# EAGLE design ArmShield (EAGLE 9.5.2)
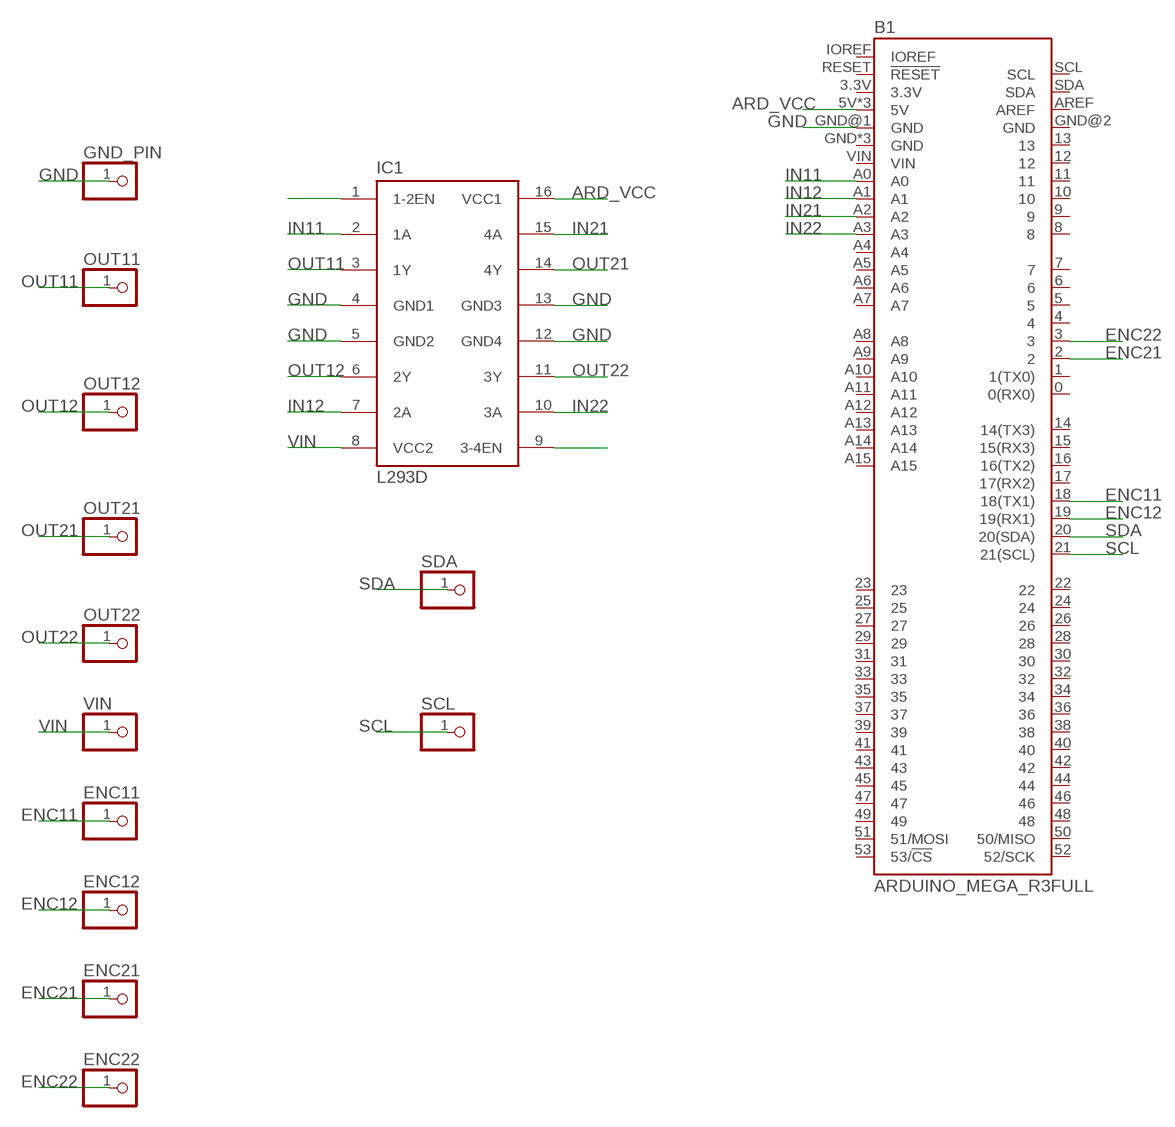
[diagram p0: schematic, sheet 1]

## Parts
B1  ARDUINO_MEGA_R3FULL  [ARDUINO_MEGA_NO_SILK]
ENC11  PINHD-1X1  [1X01]
ENC12  PINHD-1X1  [1X01]
ENC21  PINHD-1X1  [1X01]
ENC22  PINHD-1X1  [1X01]
GND_PIN  PINHD-1X1  [1X01]
IC1  L293D  [DIL16]
OUT11  PINHD-1X1  [1X01]
OUT12  PINHD-1X1  [1X01]
OUT21  PINHD-1X1  [1X01]
OUT22  PINHD-1X1  [1X01]
SCL  PINHD-1X1  [1X01]
SDA  PINHD-1X1  [1X01]
VIN  PINHD-1X1  [1X01]

## Nets
ARD_VCC: B1.5V B1.5V@1(5V) B1.5V@2(5V) IC1.16(VCC1)
ENC11: B1.18(18(TX1)) ENC11.1
ENC12: B1.19(19(RX1)) ENC12.1
ENC21: B1.2 ENC21.1
ENC22: B1.3 ENC22.1
GND: B1.GND@1(GND) GND_PIN.1 IC1.4(GND1) IC1.5(GND2) IC1.12(GND4) IC1.13(GND3)
IN11: B1.A0 IC1.2(1A)
IN12: B1.A1 IC1.7(2A)
IN21: B1.A2 IC1.15(4A)
IN22: B1.A3 IC1.10(3A)
N$2: IC1.1(1-2EN)
N$14: IC1.9(3-4EN)
OUT11: IC1.3(1Y) OUT11.1
OUT12: IC1.6(2Y) OUT12.1
OUT21: IC1.14(4Y) OUT21.1
OUT22: IC1.11(3Y) OUT22.1
SCL: B1.21(21(SCL)) SCL.1
SDA: B1.20(20(SDA)) SDA.1
VIN: IC1.8(VCC2) VIN.1
Unconnected: B1.0(0(RX0)) B1.1(1(TX0)) B1.3.3V B1.4 B1.5 B1.6 B1.7 B1.8 B1.9 B1.10 B1.11 B1.12 B1.13 B1.14(14(TX3)) B1.15(15(RX3)) B1.16(16(TX2)) B1.17(17(RX2)) B1.22 B1.23 B1.24 B1.25 B1.26 B1.27 B1.28 B1.29 B1.30 B1.31 B1.32 B1.33 B1.34 B1.35 B1.36 B1.37 B1.38 B1.39 B1.40 B1.41 B1.42 B1.43 B1.44 B1.45 B1.46 B1.47 B1.48 B1.49 B1.50(50/MISO) B1.51(51/MOSI) B1.52(52/SCK) B1.53(53/!CS) B1.A4 B1.A5 B1.A6 B1.A7 B1.A8 B1.A9 B1.A10 B1.A11 B1.A12 B1.A13 B1.A14 B1.A15 B1.AREF B1.GND B1.GND@2(GND) B1.GND@3(GND) B1.GND@4(GND) B1.IOREF B1.RESET(!RESET) B1.SCL B1.SDA B1.VIN

## Library data of the parts
B1 = SparkFun-Boards:ARDUINO_MEGA_R3: Arduino Mega R3 ATmega2560 R3 compatible footprint. SparkFun Products: Arduino Mega 2560 R3 <https://www.sparkfun.com/products/11061>
ENC11 ENC12 ENC21 ENC22 GND_PIN OUT11 OUT12 OUT21 OUT22 SCL SDA VIN = pinhead:PINHD-1X1: PIN HEADER
IC1 = st-microelectronics:L293D: PUSH-PULL 4 CHANNEL DRIVER; MPN: L293D; OC_FARNELL: 9589619; OC_NEWARK: 56P8249

## Board
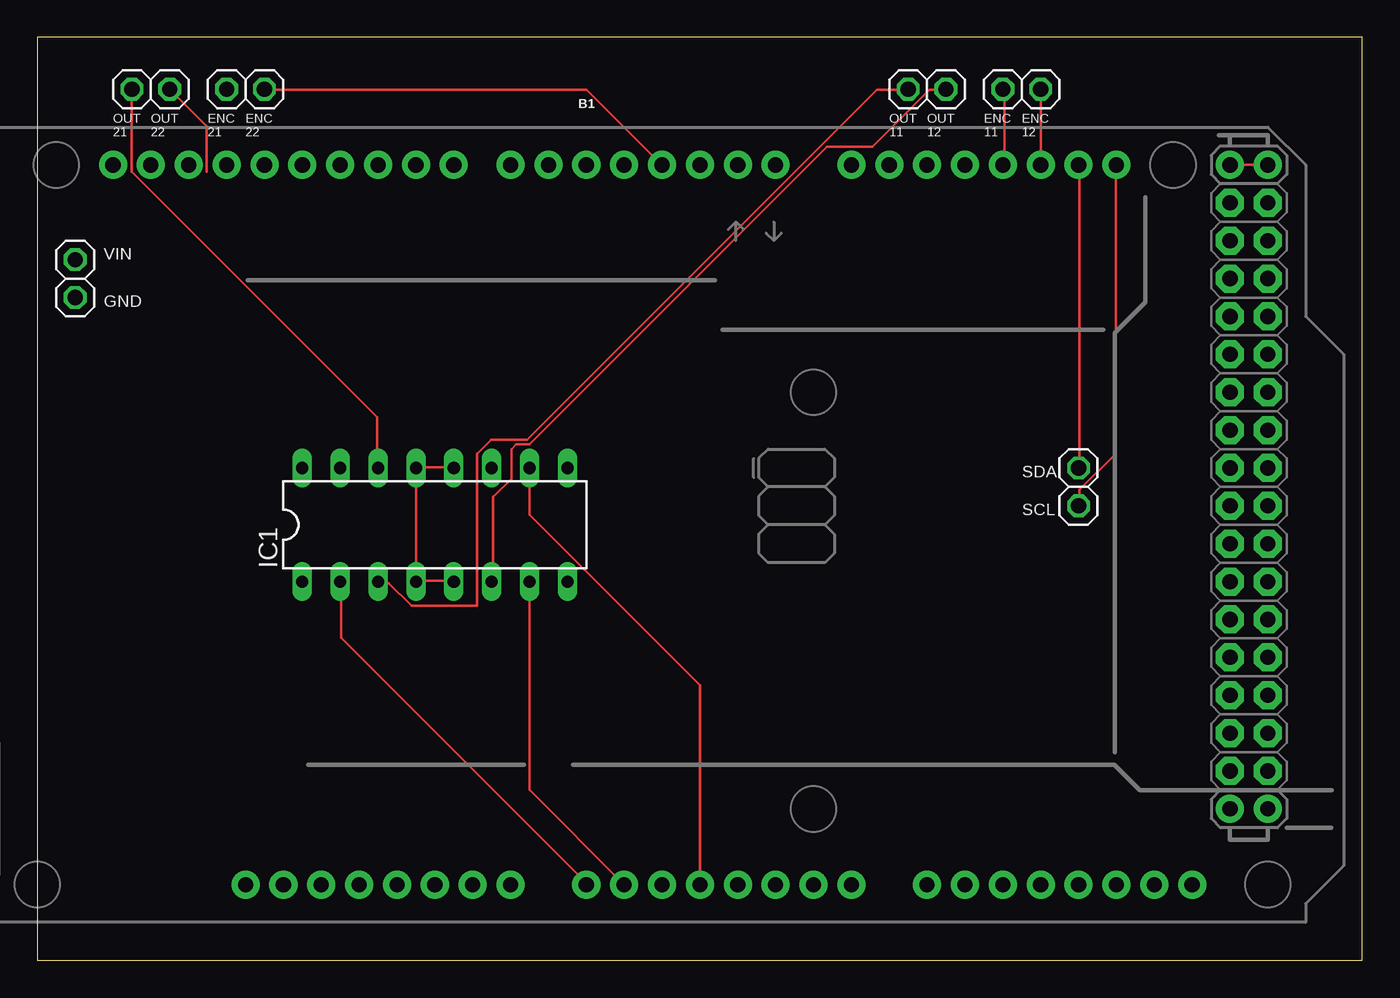
[diagram p1: board, top side]
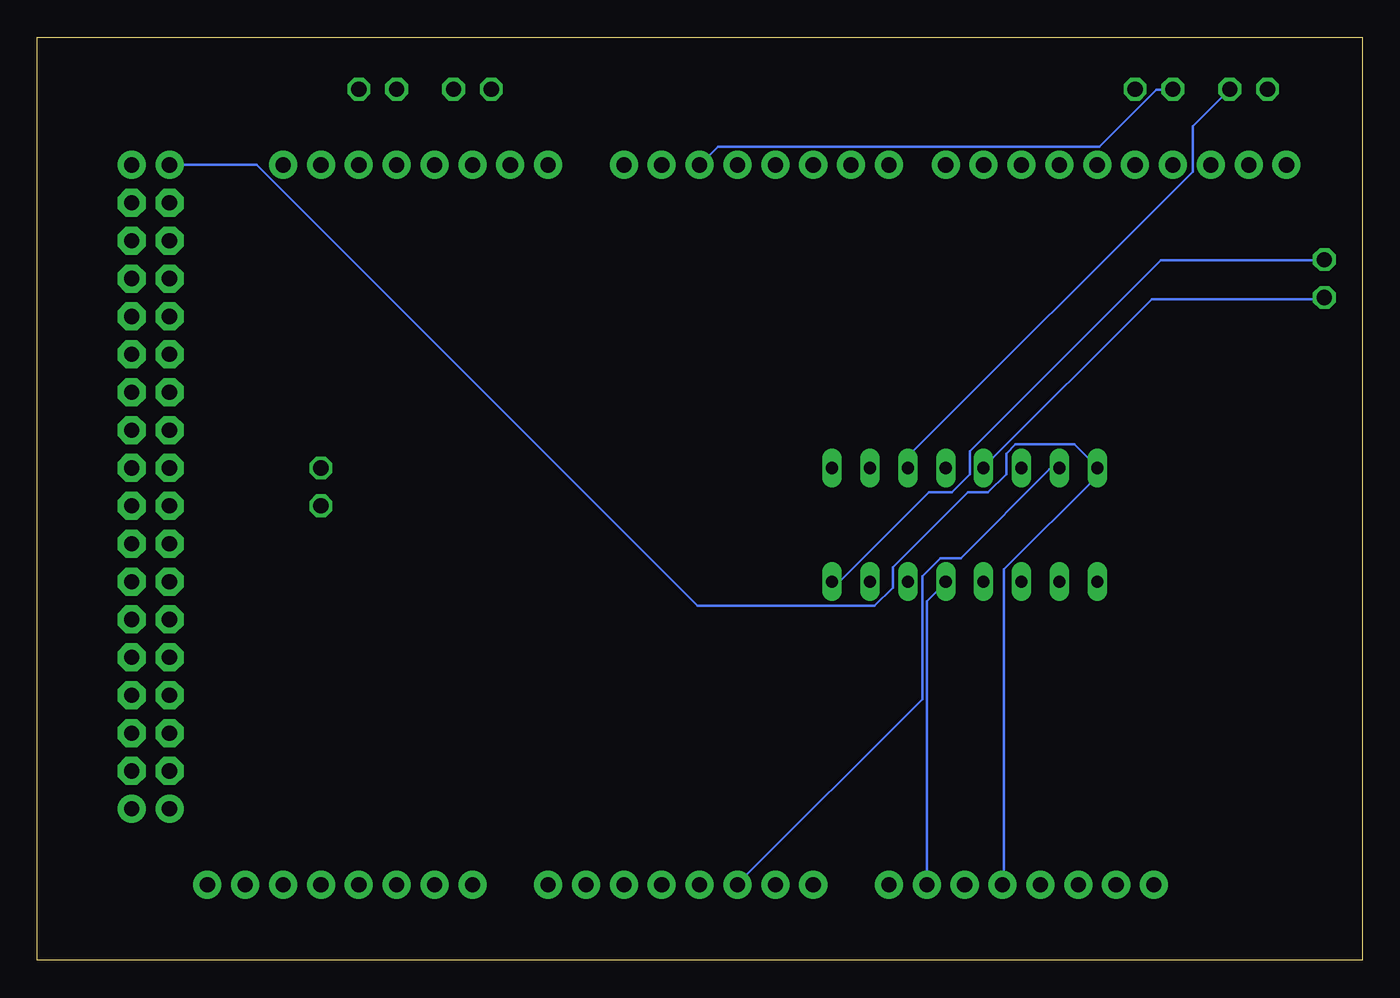
[diagram p2: board, bottom side, seen from below]

Size 88.88 x 61.9 mm. Coordinates in mm from the lower left corner, seen from the top.
Outline: 0,0 88.88,0 88.88,61.9 0,61.9 0,0
Copper layers (1*16): Top 0.035mm / dielectric 1.5mm / Bottom 0.035mm
Design rules "default": minimum track width 6mil, minimum drill 0.35mm, track to track 6mil, track to pad 6mil, pad to pad 6mil, via to via 6mil, smd to smd 6mil, copper to edge 40mil, drill to drill 6mil, minimum pad ring 10mil, minimum via ring 8mil, stop-mask expansion 4mil, vias tented up to drill 0mil, thermal gap 10mil

### Footprints (pad centres in the part's own frame; a part is rotated, then mirrored left to right if it is on the bottom)
ARDUINO_MEGA_NO_SILK = drill 1.016 pad 1.88: 0 13.97,24.13; 1 11.43,24.13; 2 8.89,24.13; 3 6.35,24.13; 3.3V -13.97,-24.13; 4 3.81,24.13; 5 1.27,24.13; 5V -11.43,-24.13; 5V@1 44.45,24.13; 5V@2 46.99,24.13; 6 -1.27,24.13; 7 -3.81,24.13; 8 -7.62,24.13; 9 -10.16,24.13; 10 -12.7,24.13; 11 -15.24,24.13; 12 -17.78,24.13; 13 -20.32,24.13; 14 19.05,24.13; 15 21.59,24.13; 16 24.13,24.13; 17 26.67,24.13; 18 29.21,24.13; 19 31.75,24.13; 20 34.29,24.13; 21 36.83,24.13; A0 1.27,-24.13; A1 3.81,-24.13; A2 6.35,-24.13; A3 8.89,-24.13; A4 11.43,-24.13; A5 13.97,-24.13; A6 16.51,-24.13; A7 19.05,-24.13; A8 24.13,-24.13; A9 26.67,-24.13; A10 29.21,-24.13; A11 31.75,-24.13; A12 34.29,-24.13; A13 36.83,-24.13; A14 39.37,-24.13; A15 41.91,-24.13; AREF -25.4,24.13; GND -8.89,-24.13; GND@1 -6.35,-24.13; GND@2 44.45,-19.05; GND@3 46.99,-19.05; GND@4 -22.86,24.13; IOREF -19.05,-24.13; NC -21.59,-24.13; RESET -16.51,-24.13; SCL -30.48,24.13; SDA -27.94,24.13; VIN -3.81,-24.13 | drill 1.016 pad 1.88 octagon: 22 44.45,21.59; 23 46.99,21.59; 24 44.45,19.05; 25 46.99,19.05; 26 44.45,16.51; 27 46.99,16.51; 28 44.45,13.97; 29 46.99,13.97; 30 44.45,11.43; 31 46.99,11.43; 32 44.45,8.89; 33 46.99,8.89; 34 44.45,6.35; 35 46.99,6.35; 36 44.45,3.81; 37 46.99,3.81; 38 44.45,1.27; 39 46.99,1.27; 40 44.45,-1.27; 41 46.99,-1.27; 42 44.45,-3.81; 43 46.99,-3.81; 44 44.45,-6.35; 45 46.99,-6.35; 46 44.45,-8.89; 47 46.99,-8.89; 48 44.45,-11.43; 49 46.99,-11.43; 50 44.45,-13.97; 51 46.99,-13.97; 52 44.45,-16.51; 53 46.99,-16.51
1X01 = drill 1.016 octagon: 1 0,0
DIL16 = drill 0.813 long: 1 -8.89,-3.81; 2 -6.35,-3.81; 3 -3.81,-3.81; 4 -1.27,-3.81; 5 1.27,-3.81; 6 3.81,-3.81; 7 6.35,-3.81; 8 8.89,-3.81; 9 8.89,3.81; 10 6.35,3.81; 11 3.81,3.81; 12 1.27,3.81; 13 -1.27,3.81; 14 -3.81,3.81; 15 -6.35,3.81; 16 -8.89,3.81

### Placement (x,y rotation side)
B1  35.56,29.21 0 top
ENC11  64.77,58.42 0 top
ENC12  67.31,58.42 0 top
ENC21  12.7,58.42 0 top
ENC22  15.24,58.42 0 top
GND_PIN  2.54,44.45 0 top
IC1  26.67,29.21 0 top
OUT11  58.42,58.42 0 top
OUT12  60.96,58.42 0 top
OUT21  6.35,58.42 0 top
OUT22  8.89,58.42 0 top
SCL  69.85,30.48 0 top
SDA  69.85,33.02 0 top
VIN  2.54,46.99 0 top

### Tracks (layer width: path | path; a pad name or v marks a point on that pad's centre or on a via)
ARD_VCC
  Top 0.152: B1.5V@2 B1.5V@1
  Bottom 0.152: B1.5V 24.03,5.18 24.03,26.21 17.78,32.46 IC1.16 17.78,33.07 19.3,34.59 23.27,34.59 23.88,33.98 23.88,32.61 25.09,31.39 26.47,31.39 31.5,26.36 31.5,24.99 32.71,23.77 44.6,23.77 74.17,53.34 B1.5V@1
ENC11
  Top 0.152: ENC11.1 64.87,58.37 64.87,53.34 B1.18
ENC12
  Top 0.152: B1.19 ENC12.1
ENC21
  Bottom 0.152: B1.2 43.23,54.56 17.63,54.56 13.82,58.37 12.75,58.37 ENC21.1
ENC22
  Top 0.152: ENC22.1 15.34,58.37 36.83,58.37 41.86,53.34 B1.3
GND
  Top 0.152: 25.4,25.45 27.84,25.45 IC1.5 | IC1.12 27.84,33.07 25.4,33.07 IC1.13 25.4,25.45 | 25.4,25.45 IC1.4
  Bottom 0.152: GND_PIN.1 2.54,44.35 14.12,44.35 25.4,33.07 IC1.13 | B1.GND@1 29.21,24.08 27.99,25.3 IC1.5
IN11
  Top 0.152: IC1.2 20.37,25.3 20.37,21.64 36.83,5.18 B1.A0
IN12
  Top 0.152: IC1.7 33.02,11.43 B1.A1
IN21
  Bottom 0.152: IC1.15 20.37,32.92 20.98,32.92 26.92,26.98 28.3,26.98 29.52,25.76 29.52,17.53 41.86,5.18 B1.A2
IN22
  Top 0.152: IC1.10 33.02,29.87 44.45,18.44 B1.A3
OUT11
  Top 0.152: OUT11.1 58.32,58.37 56.34,58.37 32.87,34.9 30.43,34.9 29.52,33.98 29.52,23.77 25.09,23.77 23.57,25.3 22.96,25.3 IC1.3
OUT12
  Top 0.152: IC1.6 30.58,25.45 30.58,31.09 31.8,32.31 31.8,34.29 32.11,34.59 33.02,34.59 52.98,54.56 56.03,54.56 59.84,58.37 60.91,58.37 OUT12.1 60.86,58.37
OUT21
  Top 0.152: OUT21.1 6.35,52.88 22.81,36.42 22.81,33.07 IC1.14
OUT22
  Top 0.152: 30.43,33.83 30.43,33.07 IC1.11 | 11.38,52.88 11.38,55.93 OUT22.1
  Bottom 0.152: OUT22.1 11.38,55.93 11.38,52.88 30.43,33.83 30.43,33.07 IC1.11
SCL
  Top 0.152: SCL.1 69.9,30.48 69.9,31.55 72.34,33.98 72.34,53.34 B1.21
SDA
  Top 0.152: SDA.1 69.9,33.07 69.9,53.34 B1.20
VIN
  Bottom 0.152: IC1.8 35.46,25.45 35,25.45 29.06,31.39 27.53,31.39 26.31,32.61 26.31,34.14 13.51,46.94 2.54,46.94 VIN.1

### Text on the board
tNames: OUT / 21 | OUT / 22 | ENC / 21 | ENC / 22 | OUT / 11 | OUT / 12 | ENC / 11 | ENC / 12 | VIN | GND | SDA | SCL